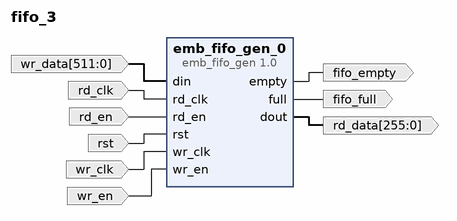
[diagram p0: block diagram of the top level]
# Vivado block design fifo_3, xcvh1582-vsva3697-2MP-e-S, Vivado 2024.2
create_bd_design fifo_3

create_bd_port -dir O fifo_full
create_bd_port -dir I wr_en
create_bd_port -dir I -from 511 -to 0 wr_data
create_bd_port -dir O fifo_empty
create_bd_port -dir I rd_en
create_bd_port -dir O -from 255 -to 0 rd_data
create_bd_port -dir I -type clk wr_clk
create_bd_port -dir I rst
create_bd_port -dir I -type clk rd_clk

create_bd_cell -type ip -vlnv xilinx.com:ip:emb_fifo_gen:1.0 emb_fifo_gen_0
set_property -dict [list \
  CONFIG.CLOCK_DOMAIN Independent_Clock \
  CONFIG.ENABLE_ALMOST_EMPTY false \
  CONFIG.ENABLE_ALMOST_FULL false \
  CONFIG.ENABLE_OVERFLOW false \
  CONFIG.ENABLE_PROGRAMMABLE_EMPTY false \
  CONFIG.ENABLE_PROGRAMMABLE_FULL false \
  CONFIG.ENABLE_READ_DATA_COUNT false \
  CONFIG.ENABLE_READ_DATA_VALID false \
  CONFIG.ENABLE_UNDERFLOW false \
  CONFIG.ENABLE_WRITE_ACK false \
  CONFIG.ENABLE_WRITE_DATA_COUNT false \
  CONFIG.FIFO_MEMORY_TYPE BRAM \
  CONFIG.FIFO_READ_LATENCY 2 \
  CONFIG.FIFO_WRITE_DEPTH 32 \
  CONFIG.READ_DATA_WIDTH 256 \
  CONFIG.WRITE_DATA_WIDTH 512 \
] [get_bd_cells emb_fifo_gen_0]

# ---- connections ----

connect_bd_net -net din_0_1 [get_bd_ports wr_data] [get_bd_pins emb_fifo_gen_0/din]
connect_bd_net [get_bd_pins emb_fifo_gen_0/dout] [get_bd_ports rd_data]
connect_bd_net [get_bd_pins emb_fifo_gen_0/empty] [get_bd_ports fifo_empty]
connect_bd_net [get_bd_pins emb_fifo_gen_0/full] [get_bd_ports fifo_full]
connect_bd_net -net rd_clk_0_1 [get_bd_ports rd_clk] [get_bd_pins emb_fifo_gen_0/rd_clk]
connect_bd_net -net rd_en_0_1 [get_bd_ports rd_en] [get_bd_pins emb_fifo_gen_0/rd_en]
connect_bd_net -net rst_0_1 [get_bd_ports rst] [get_bd_pins emb_fifo_gen_0/rst]
connect_bd_net -net wr_clk_0_1 [get_bd_ports wr_clk] [get_bd_pins emb_fifo_gen_0/wr_clk]
connect_bd_net -net wr_en_0_1 [get_bd_ports wr_en] [get_bd_pins emb_fifo_gen_0/wr_en]

validate_bd_design
save_bd_design
